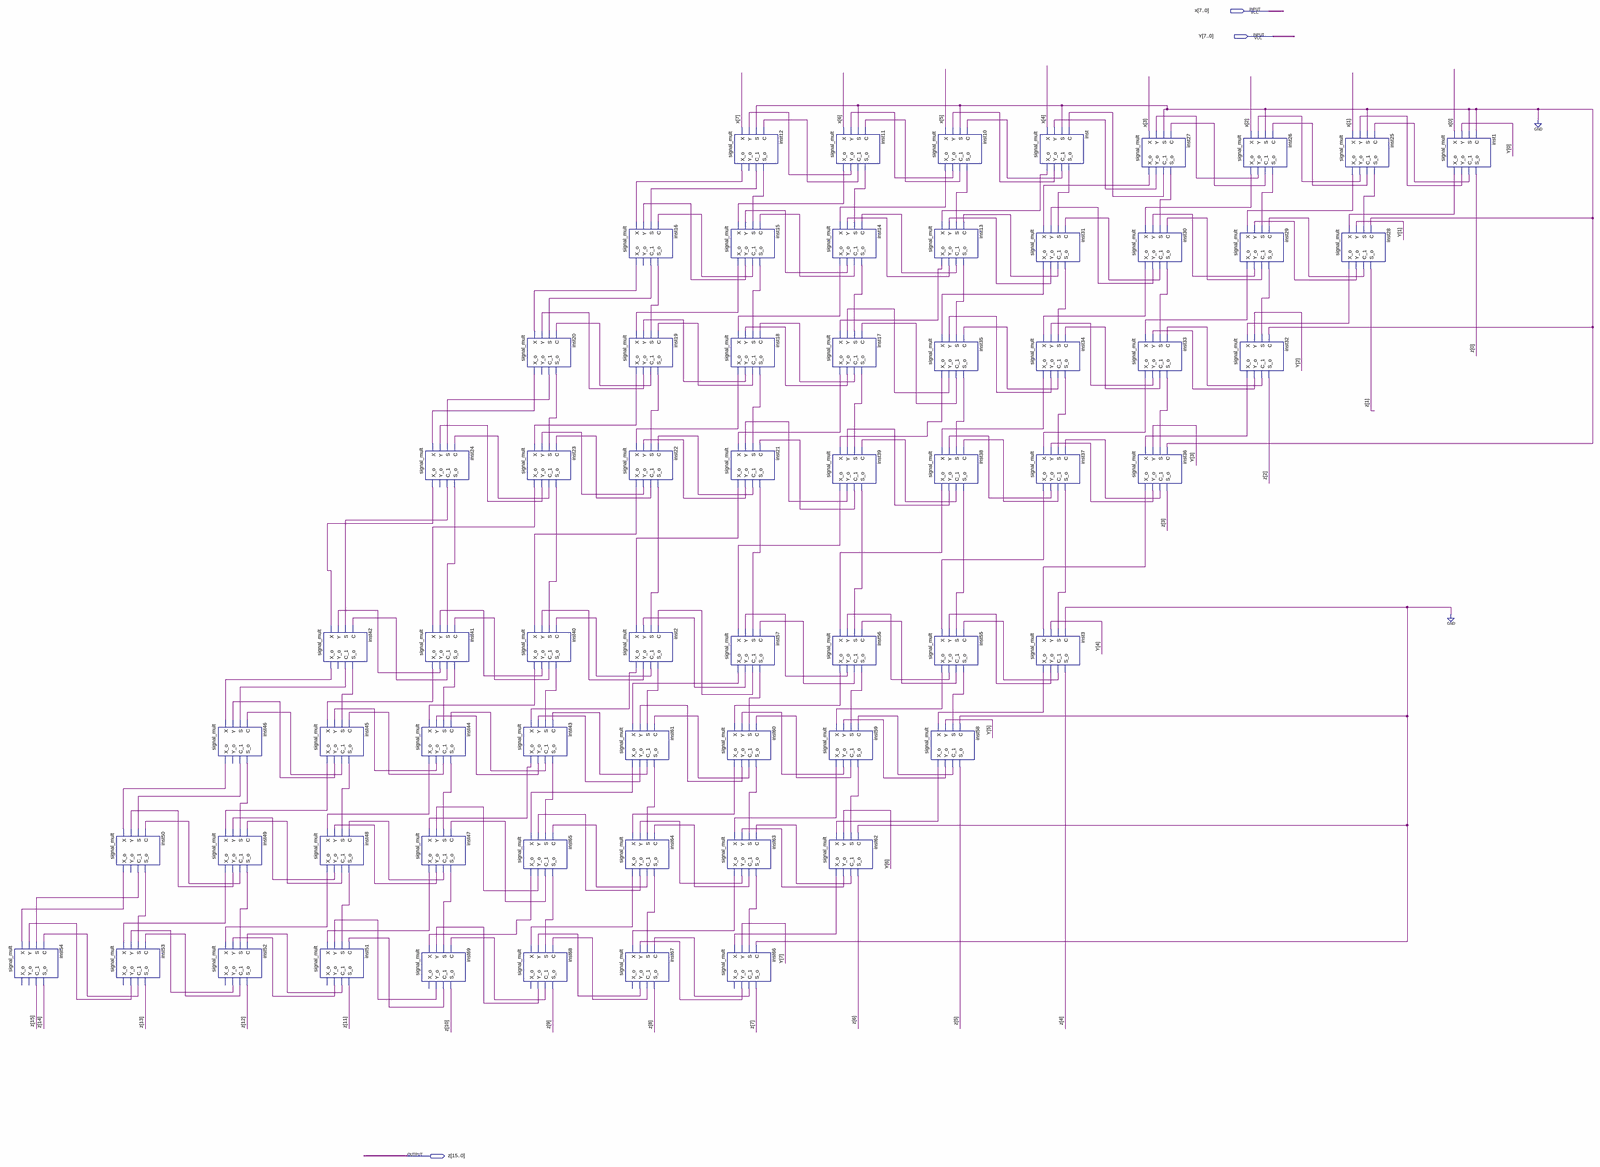
[diagram p0: schematic sheet, whole]
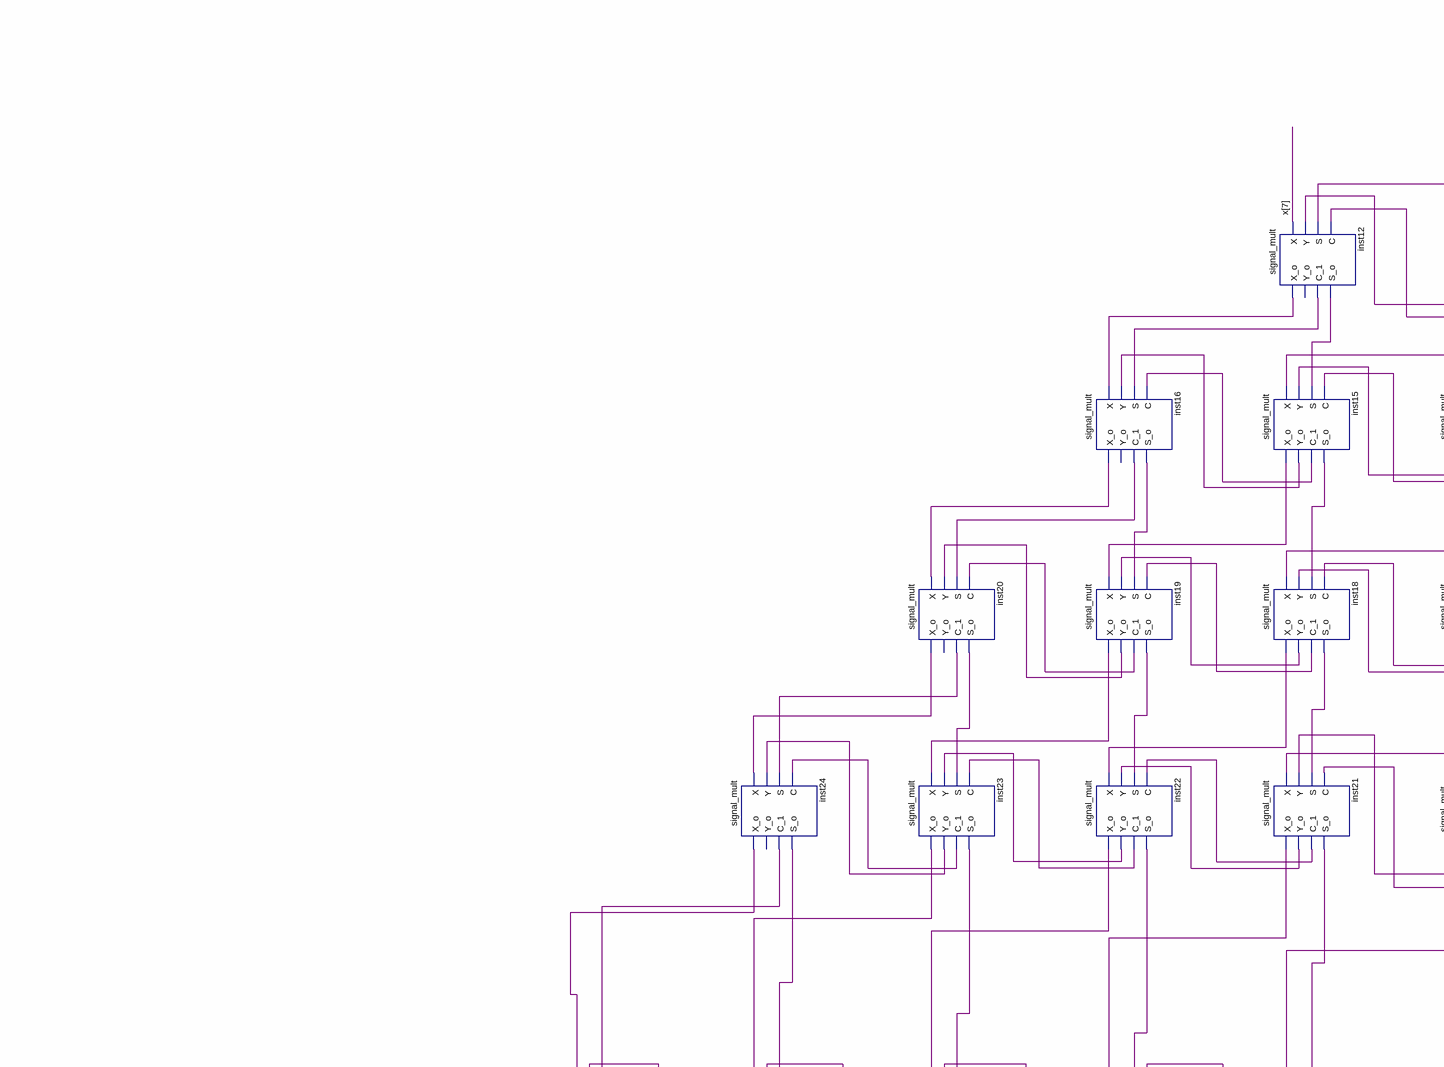
[diagram p1: schematic sheet, upper left part]
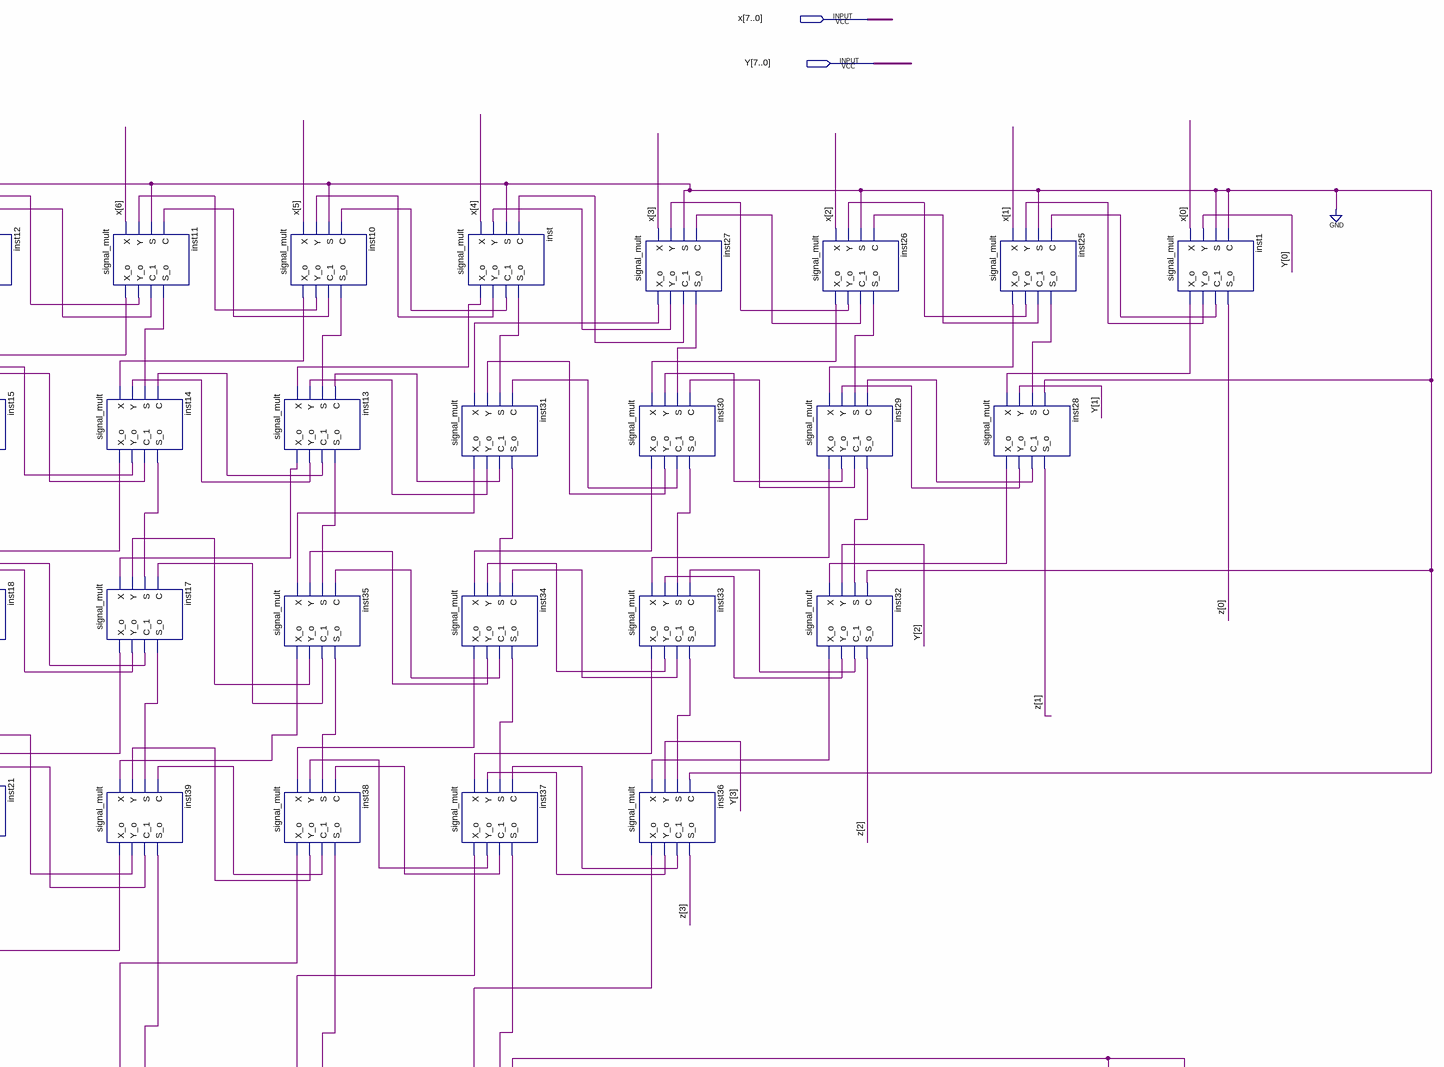
[diagram p2: schematic sheet, upper right part]
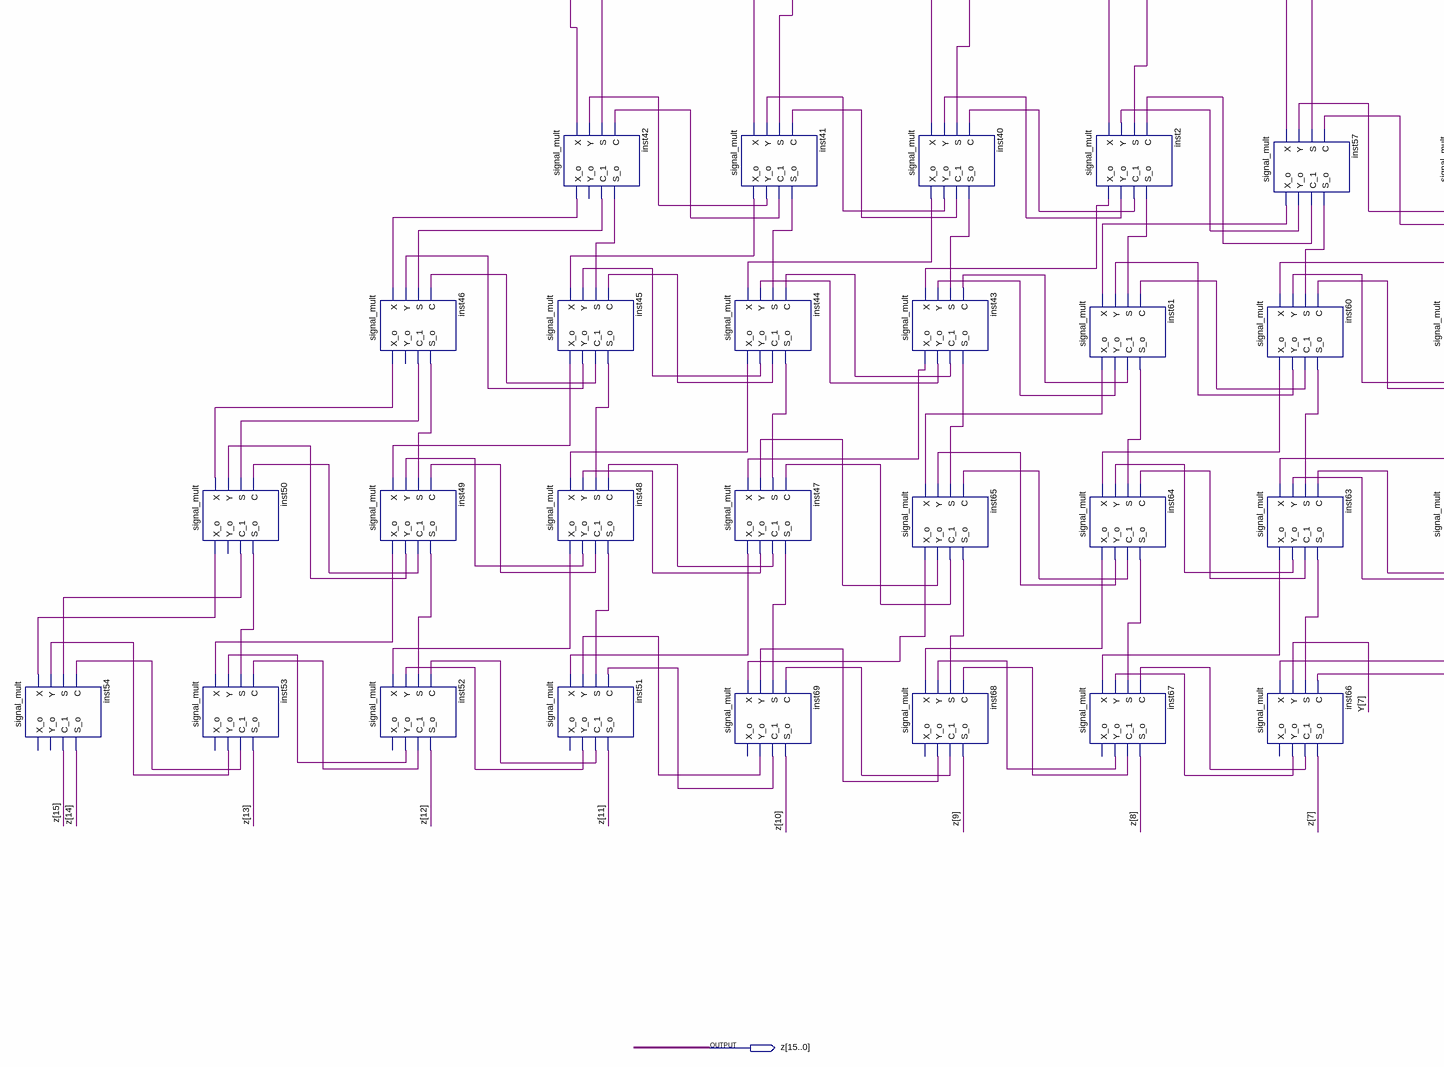
[diagram p3: schematic sheet, lower left part]
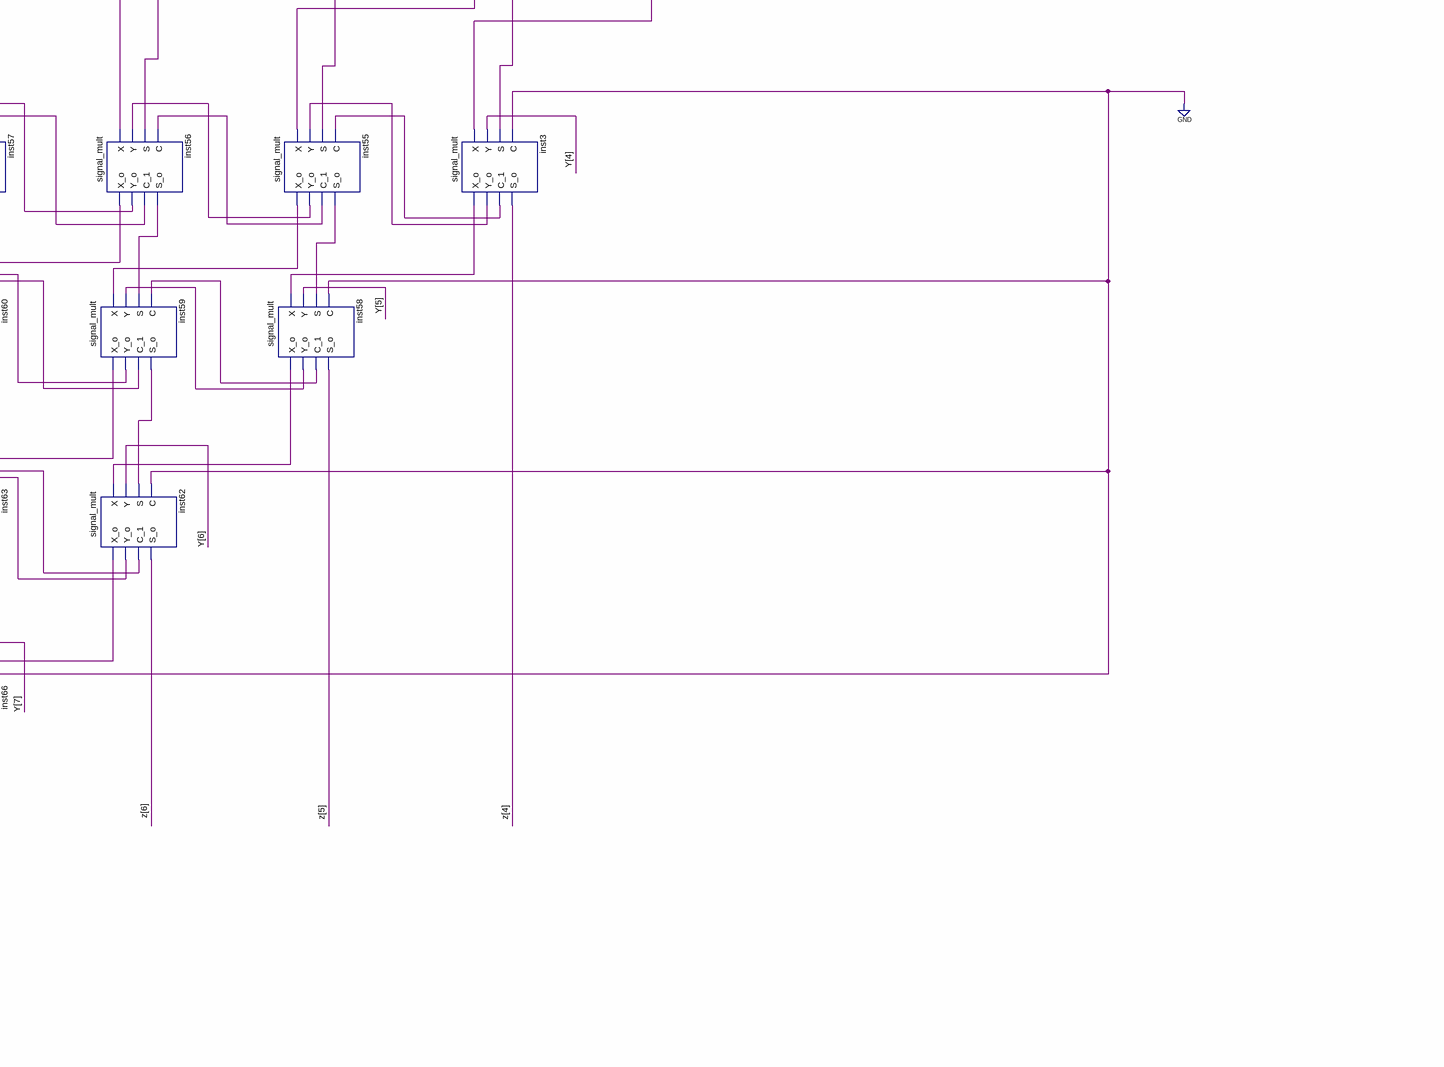
[diagram p4: schematic sheet, lower right part]
// Quartus schematic mult8.bdf as structural Verilog: 64 symbols, 3 pins
module mult8 (
  input  [7:0] x,
  input  [7:0] Y,
  output [15:0] z
);

  wire inst1_c_1, inst1_x_o, inst1_y_o, inst2_c_1, inst2_s_o, inst2_x_o, inst2_y_o, inst3_c_1, inst3_x_o,
       inst3_y_o, inst10_c_1, inst10_s_o, inst10_x_o, inst10_y_o, inst11_c_1, inst11_s_o, inst11_x_o,
       inst11_y_o, inst12_c_1, inst12_s_o, inst12_x_o, inst13_c_1, inst13_s_o, inst13_x_o, inst13_y_o,
       inst14_c_1, inst14_s_o, inst14_x_o, inst14_y_o, inst15_c_1, inst15_s_o, inst15_x_o, inst15_y_o,
       inst16_c_1, inst16_s_o, inst16_x_o, inst17_c_1, inst17_s_o, inst17_x_o, inst17_y_o, inst18_c_1,
       inst18_s_o, inst18_x_o, inst18_y_o, inst19_c_1, inst19_s_o, inst19_x_o, inst19_y_o, inst20_c_1,
       inst20_s_o, inst20_x_o, inst21_c_1, inst21_s_o, inst21_x_o, inst21_y_o, inst22_c_1, inst22_s_o,
       inst22_x_o, inst22_y_o, inst23_c_1, inst23_s_o, inst23_x_o, inst23_y_o, inst24_c_1, inst24_s_o,
       inst24_x_o, inst25_c_1, inst25_s_o, inst25_x_o, inst25_y_o, inst26_c_1, inst26_s_o, inst26_x_o,
       inst26_y_o, inst27_c_1, inst27_s_o, inst27_x_o, inst27_y_o, inst28_c_1, inst28_x_o, inst28_y_o,
       inst29_c_1, inst29_s_o, inst29_x_o, inst29_y_o, inst30_c_1, inst30_s_o, inst30_x_o, inst30_y_o,
       inst31_c_1, inst31_s_o, inst31_x_o, inst31_y_o, inst32_c_1, inst32_x_o, inst32_y_o, inst33_c_1,
       inst33_s_o, inst33_x_o, inst33_y_o, inst34_c_1, inst34_s_o, inst34_x_o, inst34_y_o, inst35_c_1,
       inst35_s_o, inst35_x_o, inst35_y_o, inst36_c_1, inst36_x_o, inst36_y_o, inst37_c_1, inst37_s_o,
       inst37_x_o, inst37_y_o, inst38_c_1, inst38_s_o, inst38_x_o, inst38_y_o, inst39_c_1, inst39_s_o,
       inst39_x_o, inst39_y_o, inst40_c_1, inst40_s_o, inst40_x_o, inst40_y_o, inst41_c_1, inst41_s_o,
       inst41_x_o, inst41_y_o, inst42_c_1, inst42_s_o, inst42_x_o, inst43_c_1, inst43_s_o, inst43_x_o,
       inst43_y_o, inst44_c_1, inst44_s_o, inst44_x_o, inst44_y_o, inst45_c_1, inst45_s_o, inst45_x_o,
       inst45_y_o, inst46_c_1, inst46_s_o, inst46_x_o, inst47_c_1, inst47_s_o, inst47_x_o, inst47_y_o,
       inst48_c_1, inst48_s_o, inst48_x_o, inst48_y_o, inst49_c_1, inst49_s_o, inst49_x_o, inst49_y_o,
       inst50_c_1, inst50_s_o, inst50_x_o, inst51_c_1, inst51_y_o, inst52_c_1, inst52_y_o, inst53_c_1,
       inst53_y_o, inst55_c_1, inst55_s_o, inst55_x_o, inst55_y_o, inst56_c_1, inst56_s_o, inst56_x_o,
       inst56_y_o, inst57_c_1, inst57_s_o, inst57_x_o, inst57_y_o, inst58_c_1, inst58_x_o, inst58_y_o,
       inst59_c_1, inst59_s_o, inst59_x_o, inst59_y_o, inst60_c_1, inst60_s_o, inst60_x_o, inst60_y_o,
       inst61_c_1, inst61_s_o, inst61_x_o, inst61_y_o, inst62_c_1, inst62_x_o, inst62_y_o, inst63_c_1,
       inst63_s_o, inst63_x_o, inst63_y_o, inst64_c_1, inst64_s_o, inst64_x_o, inst64_y_o, inst65_c_1,
       inst65_s_o, inst65_x_o, inst65_y_o, inst66_c_1, inst66_y_o, inst67_c_1, inst67_y_o, inst68_c_1,
       inst68_y_o, inst69_c_1, inst69_y_o, inst_c_1, inst_s_o, inst_x_o, inst_y_o;

  signal_mult inst54 (
    .X(inst50_x_o), .Y(inst53_y_o), .S(inst50_c_1), .C(inst53_c_1), .C_1(z[15]), .S_o(z[14]));  // open: X_o, Y_o
  signal_mult inst50 (
    .X(inst46_x_o), .Y(inst49_y_o), .S(inst46_c_1), .C(inst49_c_1), .X_o(inst50_x_o), .C_1(inst50_c_1),
    .S_o(inst50_s_o));  // open: Y_o
  signal_mult inst53 (
    .X(inst49_x_o), .Y(inst52_y_o), .S(inst50_s_o), .C(inst52_c_1), .Y_o(inst53_y_o), .C_1(inst53_c_1),
    .S_o(z[13]));  // open: X_o
  signal_mult inst46 (
    .X(inst42_x_o), .Y(inst45_y_o), .S(inst42_c_1), .C(inst45_c_1), .X_o(inst46_x_o), .C_1(inst46_c_1),
    .S_o(inst46_s_o));  // open: Y_o
  signal_mult inst49 (
    .X(inst45_x_o), .Y(inst48_y_o), .S(inst46_s_o), .C(inst48_c_1), .X_o(inst49_x_o), .Y_o(inst49_y_o),
    .C_1(inst49_c_1), .S_o(inst49_s_o));
  signal_mult inst52 (
    .X(inst48_x_o), .Y(inst51_y_o), .S(inst49_s_o), .C(inst51_c_1), .Y_o(inst52_y_o), .C_1(inst52_c_1),
    .S_o(z[12]));  // open: X_o
  signal_mult inst42 (
    .X(inst24_x_o), .Y(inst41_y_o), .S(inst24_c_1), .C(inst41_c_1), .X_o(inst42_x_o), .C_1(inst42_c_1),
    .S_o(inst42_s_o));  // open: Y_o
  signal_mult inst45 (
    .X(inst41_x_o), .Y(inst44_y_o), .S(inst42_s_o), .C(inst44_c_1), .X_o(inst45_x_o), .Y_o(inst45_y_o),
    .C_1(inst45_c_1), .S_o(inst45_s_o));
  signal_mult inst48 (
    .X(inst44_x_o), .Y(inst47_y_o), .S(inst45_s_o), .C(inst47_c_1), .X_o(inst48_x_o), .Y_o(inst48_y_o),
    .C_1(inst48_c_1), .S_o(inst48_s_o));
  signal_mult inst51 (
    .X(inst47_x_o), .Y(inst69_y_o), .S(inst48_s_o), .C(inst69_c_1), .Y_o(inst51_y_o), .C_1(inst51_c_1),
    .S_o(z[11]));  // open: X_o
  signal_mult inst24 (
    .X(inst20_x_o), .Y(inst23_y_o), .S(inst20_c_1), .C(inst23_c_1), .X_o(inst24_x_o), .C_1(inst24_c_1),
    .S_o(inst24_s_o));  // open: Y_o
  signal_mult inst41 (
    .X(inst23_x_o), .Y(inst40_y_o), .S(inst24_s_o), .C(inst40_c_1), .X_o(inst41_x_o), .Y_o(inst41_y_o),
    .C_1(inst41_c_1), .S_o(inst41_s_o));
  signal_mult inst44 (
    .X(inst40_x_o), .Y(inst43_y_o), .S(inst41_s_o), .C(inst43_c_1), .X_o(inst44_x_o), .Y_o(inst44_y_o),
    .C_1(inst44_c_1), .S_o(inst44_s_o));
  signal_mult inst47 (
    .X(inst43_x_o), .Y(inst65_y_o), .S(inst44_s_o), .C(inst65_c_1), .X_o(inst47_x_o), .Y_o(inst47_y_o),
    .C_1(inst47_c_1), .S_o(inst47_s_o));
  signal_mult inst69 (
    .X(inst65_x_o), .Y(inst68_y_o), .S(inst47_s_o), .C(inst68_c_1), .Y_o(inst69_y_o), .C_1(inst69_c_1),
    .S_o(z[10]));  // open: X_o
  signal_mult inst20 (
    .X(inst16_x_o), .Y(inst19_y_o), .S(inst16_c_1), .C(inst19_c_1), .X_o(inst20_x_o), .C_1(inst20_c_1),
    .S_o(inst20_s_o));  // open: Y_o
  signal_mult inst23 (
    .X(inst19_x_o), .Y(inst22_y_o), .S(inst20_s_o), .C(inst22_c_1), .X_o(inst23_x_o), .Y_o(inst23_y_o),
    .C_1(inst23_c_1), .S_o(inst23_s_o));
  signal_mult inst40 (
    .X(inst22_x_o), .Y(inst2_y_o), .S(inst23_s_o), .C(inst2_c_1), .X_o(inst40_x_o), .Y_o(inst40_y_o),
    .C_1(inst40_c_1), .S_o(inst40_s_o));
  signal_mult inst43 (
    .X(inst2_x_o), .Y(inst61_y_o), .S(inst40_s_o), .C(inst61_c_1), .X_o(inst43_x_o), .Y_o(inst43_y_o),
    .C_1(inst43_c_1), .S_o(inst43_s_o));
  signal_mult inst65 (
    .X(inst61_x_o), .Y(inst64_y_o), .S(inst43_s_o), .C(inst64_c_1), .X_o(inst65_x_o), .Y_o(inst65_y_o),
    .C_1(inst65_c_1), .S_o(inst65_s_o));
  signal_mult inst68 (
    .X(inst64_x_o), .Y(inst67_y_o), .S(inst65_s_o), .C(inst67_c_1), .Y_o(inst68_y_o), .C_1(inst68_c_1),
    .S_o(z[9]));  // open: X_o
  signal_mult inst16 (
    .X(inst12_x_o), .Y(inst15_y_o), .S(inst12_c_1), .C(inst15_c_1), .X_o(inst16_x_o), .C_1(inst16_c_1),
    .S_o(inst16_s_o));  // open: Y_o
  signal_mult inst19 (
    .X(inst15_x_o), .Y(inst18_y_o), .S(inst16_s_o), .C(inst18_c_1), .X_o(inst19_x_o), .Y_o(inst19_y_o),
    .C_1(inst19_c_1), .S_o(inst19_s_o));
  signal_mult inst22 (
    .X(inst18_x_o), .Y(inst21_y_o), .S(inst19_s_o), .C(inst21_c_1), .X_o(inst22_x_o), .Y_o(inst22_y_o),
    .C_1(inst22_c_1), .S_o(inst22_s_o));
  signal_mult inst2 (
    .X(inst21_x_o), .Y(inst57_y_o), .S(inst22_s_o), .C(inst57_c_1), .X_o(inst2_x_o), .Y_o(inst2_y_o),
    .C_1(inst2_c_1), .S_o(inst2_s_o));
  signal_mult inst61 (
    .X(inst57_x_o), .Y(inst60_y_o), .S(inst2_s_o), .C(inst60_c_1), .X_o(inst61_x_o), .Y_o(inst61_y_o),
    .C_1(inst61_c_1), .S_o(inst61_s_o));
  signal_mult inst64 (
    .X(inst60_x_o), .Y(inst63_y_o), .S(inst61_s_o), .C(inst63_c_1), .X_o(inst64_x_o), .Y_o(inst64_y_o),
    .C_1(inst64_c_1), .S_o(inst64_s_o));
  signal_mult inst67 (
    .X(inst63_x_o), .Y(inst66_y_o), .S(inst64_s_o), .C(inst66_c_1), .Y_o(inst67_y_o), .C_1(inst67_c_1),
    .S_o(z[8]));  // open: X_o
  signal_mult inst12 (
    .X(x[7]), .Y(inst11_y_o), .S(1'b0), .C(inst11_c_1), .X_o(inst12_x_o), .C_1(inst12_c_1), .S_o(inst12_s_o));  // open: Y_o
  signal_mult inst15 (
    .X(inst11_x_o), .Y(inst14_y_o), .S(inst12_s_o), .C(inst14_c_1), .X_o(inst15_x_o), .Y_o(inst15_y_o),
    .C_1(inst15_c_1), .S_o(inst15_s_o));
  signal_mult inst18 (
    .X(inst14_x_o), .Y(inst17_y_o), .S(inst15_s_o), .C(inst17_c_1), .X_o(inst18_x_o), .Y_o(inst18_y_o),
    .C_1(inst18_c_1), .S_o(inst18_s_o));
  signal_mult inst21 (
    .X(inst17_x_o), .Y(inst39_y_o), .S(inst18_s_o), .C(inst39_c_1), .X_o(inst21_x_o), .Y_o(inst21_y_o),
    .C_1(inst21_c_1), .S_o(inst21_s_o));
  signal_mult inst57 (
    .X(inst39_x_o), .Y(inst56_y_o), .S(inst21_s_o), .C(inst56_c_1), .X_o(inst57_x_o), .Y_o(inst57_y_o),
    .C_1(inst57_c_1), .S_o(inst57_s_o));
  signal_mult inst60 (
    .X(inst56_x_o), .Y(inst59_y_o), .S(inst57_s_o), .C(inst59_c_1), .X_o(inst60_x_o), .Y_o(inst60_y_o),
    .C_1(inst60_c_1), .S_o(inst60_s_o));
  signal_mult inst63 (
    .X(inst59_x_o), .Y(inst62_y_o), .S(inst60_s_o), .C(inst62_c_1), .X_o(inst63_x_o), .Y_o(inst63_y_o),
    .C_1(inst63_c_1), .S_o(inst63_s_o));
  signal_mult inst66 (
    .X(inst62_x_o), .Y(Y[7]), .S(inst63_s_o), .C(1'b0), .Y_o(inst66_y_o), .C_1(inst66_c_1), .S_o(z[7]));  // open: X_o
  signal_mult inst11 (
    .X(x[6]), .Y(inst10_y_o), .S(1'b0), .C(inst10_c_1), .X_o(inst11_x_o), .Y_o(inst11_y_o), .C_1(inst11_c_1),
    .S_o(inst11_s_o));
  signal_mult inst14 (
    .X(inst10_x_o), .Y(inst13_y_o), .S(inst11_s_o), .C(inst13_c_1), .X_o(inst14_x_o), .Y_o(inst14_y_o),
    .C_1(inst14_c_1), .S_o(inst14_s_o));
  signal_mult inst17 (
    .X(inst13_x_o), .Y(inst35_y_o), .S(inst14_s_o), .C(inst35_c_1), .X_o(inst17_x_o), .Y_o(inst17_y_o),
    .C_1(inst17_c_1), .S_o(inst17_s_o));
  signal_mult inst39 (
    .X(inst35_x_o), .Y(inst38_y_o), .S(inst17_s_o), .C(inst38_c_1), .X_o(inst39_x_o), .Y_o(inst39_y_o),
    .C_1(inst39_c_1), .S_o(inst39_s_o));
  signal_mult inst56 (
    .X(inst38_x_o), .Y(inst55_y_o), .S(inst39_s_o), .C(inst55_c_1), .X_o(inst56_x_o), .Y_o(inst56_y_o),
    .C_1(inst56_c_1), .S_o(inst56_s_o));
  signal_mult inst59 (
    .X(inst55_x_o), .Y(inst58_y_o), .S(inst56_s_o), .C(inst58_c_1), .X_o(inst59_x_o), .Y_o(inst59_y_o),
    .C_1(inst59_c_1), .S_o(inst59_s_o));
  signal_mult inst62 (
    .X(inst58_x_o), .Y(Y[6]), .S(inst59_s_o), .C(1'b0), .X_o(inst62_x_o), .Y_o(inst62_y_o), .C_1(inst62_c_1),
    .S_o(z[6]));
  signal_mult inst10 (
    .X(x[5]), .Y(inst_y_o), .S(1'b0), .C(inst_c_1), .X_o(inst10_x_o), .Y_o(inst10_y_o), .C_1(inst10_c_1),
    .S_o(inst10_s_o));
  signal_mult inst13 (
    .X(inst_x_o), .Y(inst31_y_o), .S(inst10_s_o), .C(inst31_c_1), .X_o(inst13_x_o), .Y_o(inst13_y_o),
    .C_1(inst13_c_1), .S_o(inst13_s_o));
  signal_mult inst35 (
    .X(inst31_x_o), .Y(inst34_y_o), .S(inst13_s_o), .C(inst34_c_1), .X_o(inst35_x_o), .Y_o(inst35_y_o),
    .C_1(inst35_c_1), .S_o(inst35_s_o));
  signal_mult inst38 (
    .X(inst34_x_o), .Y(inst37_y_o), .S(inst35_s_o), .C(inst37_c_1), .X_o(inst38_x_o), .Y_o(inst38_y_o),
    .C_1(inst38_c_1), .S_o(inst38_s_o));
  signal_mult inst55 (
    .X(inst37_x_o), .Y(inst3_y_o), .S(inst38_s_o), .C(inst3_c_1), .X_o(inst55_x_o), .Y_o(inst55_y_o),
    .C_1(inst55_c_1), .S_o(inst55_s_o));
  signal_mult inst58 (
    .X(inst3_x_o), .Y(Y[5]), .S(inst55_s_o), .C(1'b0), .X_o(inst58_x_o), .Y_o(inst58_y_o), .C_1(inst58_c_1),
    .S_o(z[5]));
  signal_mult inst (
    .X(x[4]), .Y(inst27_y_o), .S(1'b0), .C(inst27_c_1), .X_o(inst_x_o), .Y_o(inst_y_o), .C_1(inst_c_1),
    .S_o(inst_s_o));
  signal_mult inst31 (
    .X(inst27_x_o), .Y(inst30_y_o), .S(inst_s_o), .C(inst30_c_1), .X_o(inst31_x_o), .Y_o(inst31_y_o),
    .C_1(inst31_c_1), .S_o(inst31_s_o));
  signal_mult inst34 (
    .X(inst30_x_o), .Y(inst33_y_o), .S(inst31_s_o), .C(inst33_c_1), .X_o(inst34_x_o), .Y_o(inst34_y_o),
    .C_1(inst34_c_1), .S_o(inst34_s_o));
  signal_mult inst37 (
    .X(inst33_x_o), .Y(inst36_y_o), .S(inst34_s_o), .C(inst36_c_1), .X_o(inst37_x_o), .Y_o(inst37_y_o),
    .C_1(inst37_c_1), .S_o(inst37_s_o));
  signal_mult inst3 (
    .X(inst36_x_o), .Y(Y[4]), .S(inst37_s_o), .C(1'b0), .X_o(inst3_x_o), .Y_o(inst3_y_o), .C_1(inst3_c_1),
    .S_o(z[4]));
  signal_mult inst27 (
    .X(x[3]), .Y(inst26_y_o), .S(1'b0), .C(inst26_c_1), .X_o(inst27_x_o), .Y_o(inst27_y_o), .C_1(inst27_c_1),
    .S_o(inst27_s_o));
  signal_mult inst30 (
    .X(inst26_x_o), .Y(inst29_y_o), .S(inst27_s_o), .C(inst29_c_1), .X_o(inst30_x_o), .Y_o(inst30_y_o),
    .C_1(inst30_c_1), .S_o(inst30_s_o));
  signal_mult inst33 (
    .X(inst29_x_o), .Y(inst32_y_o), .S(inst30_s_o), .C(inst32_c_1), .X_o(inst33_x_o), .Y_o(inst33_y_o),
    .C_1(inst33_c_1), .S_o(inst33_s_o));
  signal_mult inst36 (
    .X(inst32_x_o), .Y(Y[3]), .S(inst33_s_o), .C(1'b0), .X_o(inst36_x_o), .Y_o(inst36_y_o), .C_1(inst36_c_1),
    .S_o(z[3]));
  signal_mult inst26 (
    .X(x[2]), .Y(inst25_y_o), .S(1'b0), .C(inst25_c_1), .X_o(inst26_x_o), .Y_o(inst26_y_o), .C_1(inst26_c_1),
    .S_o(inst26_s_o));
  signal_mult inst29 (
    .X(inst25_x_o), .Y(inst28_y_o), .S(inst26_s_o), .C(inst28_c_1), .X_o(inst29_x_o), .Y_o(inst29_y_o),
    .C_1(inst29_c_1), .S_o(inst29_s_o));
  signal_mult inst32 (
    .X(inst28_x_o), .Y(Y[2]), .S(inst29_s_o), .C(1'b0), .X_o(inst32_x_o), .Y_o(inst32_y_o), .C_1(inst32_c_1),
    .S_o(z[2]));
  signal_mult inst25 (
    .X(x[1]), .Y(inst1_y_o), .S(1'b0), .C(inst1_c_1), .X_o(inst25_x_o), .Y_o(inst25_y_o), .C_1(inst25_c_1),
    .S_o(inst25_s_o));
  signal_mult inst28 (
    .X(inst1_x_o), .Y(Y[1]), .S(inst25_s_o), .C(1'b0), .X_o(inst28_x_o), .Y_o(inst28_y_o), .C_1(inst28_c_1),
    .S_o(z[1]));
  signal_mult inst1 (
    .X(x[0]), .Y(Y[0]), .S(1'b0), .C(1'b0), .X_o(inst1_x_o), .Y_o(inst1_y_o), .C_1(inst1_c_1), .S_o(z[0]));
endmodule
